# Altium schematic sheet SH30 - POWER.SchDoc
size 386 x 246 mm
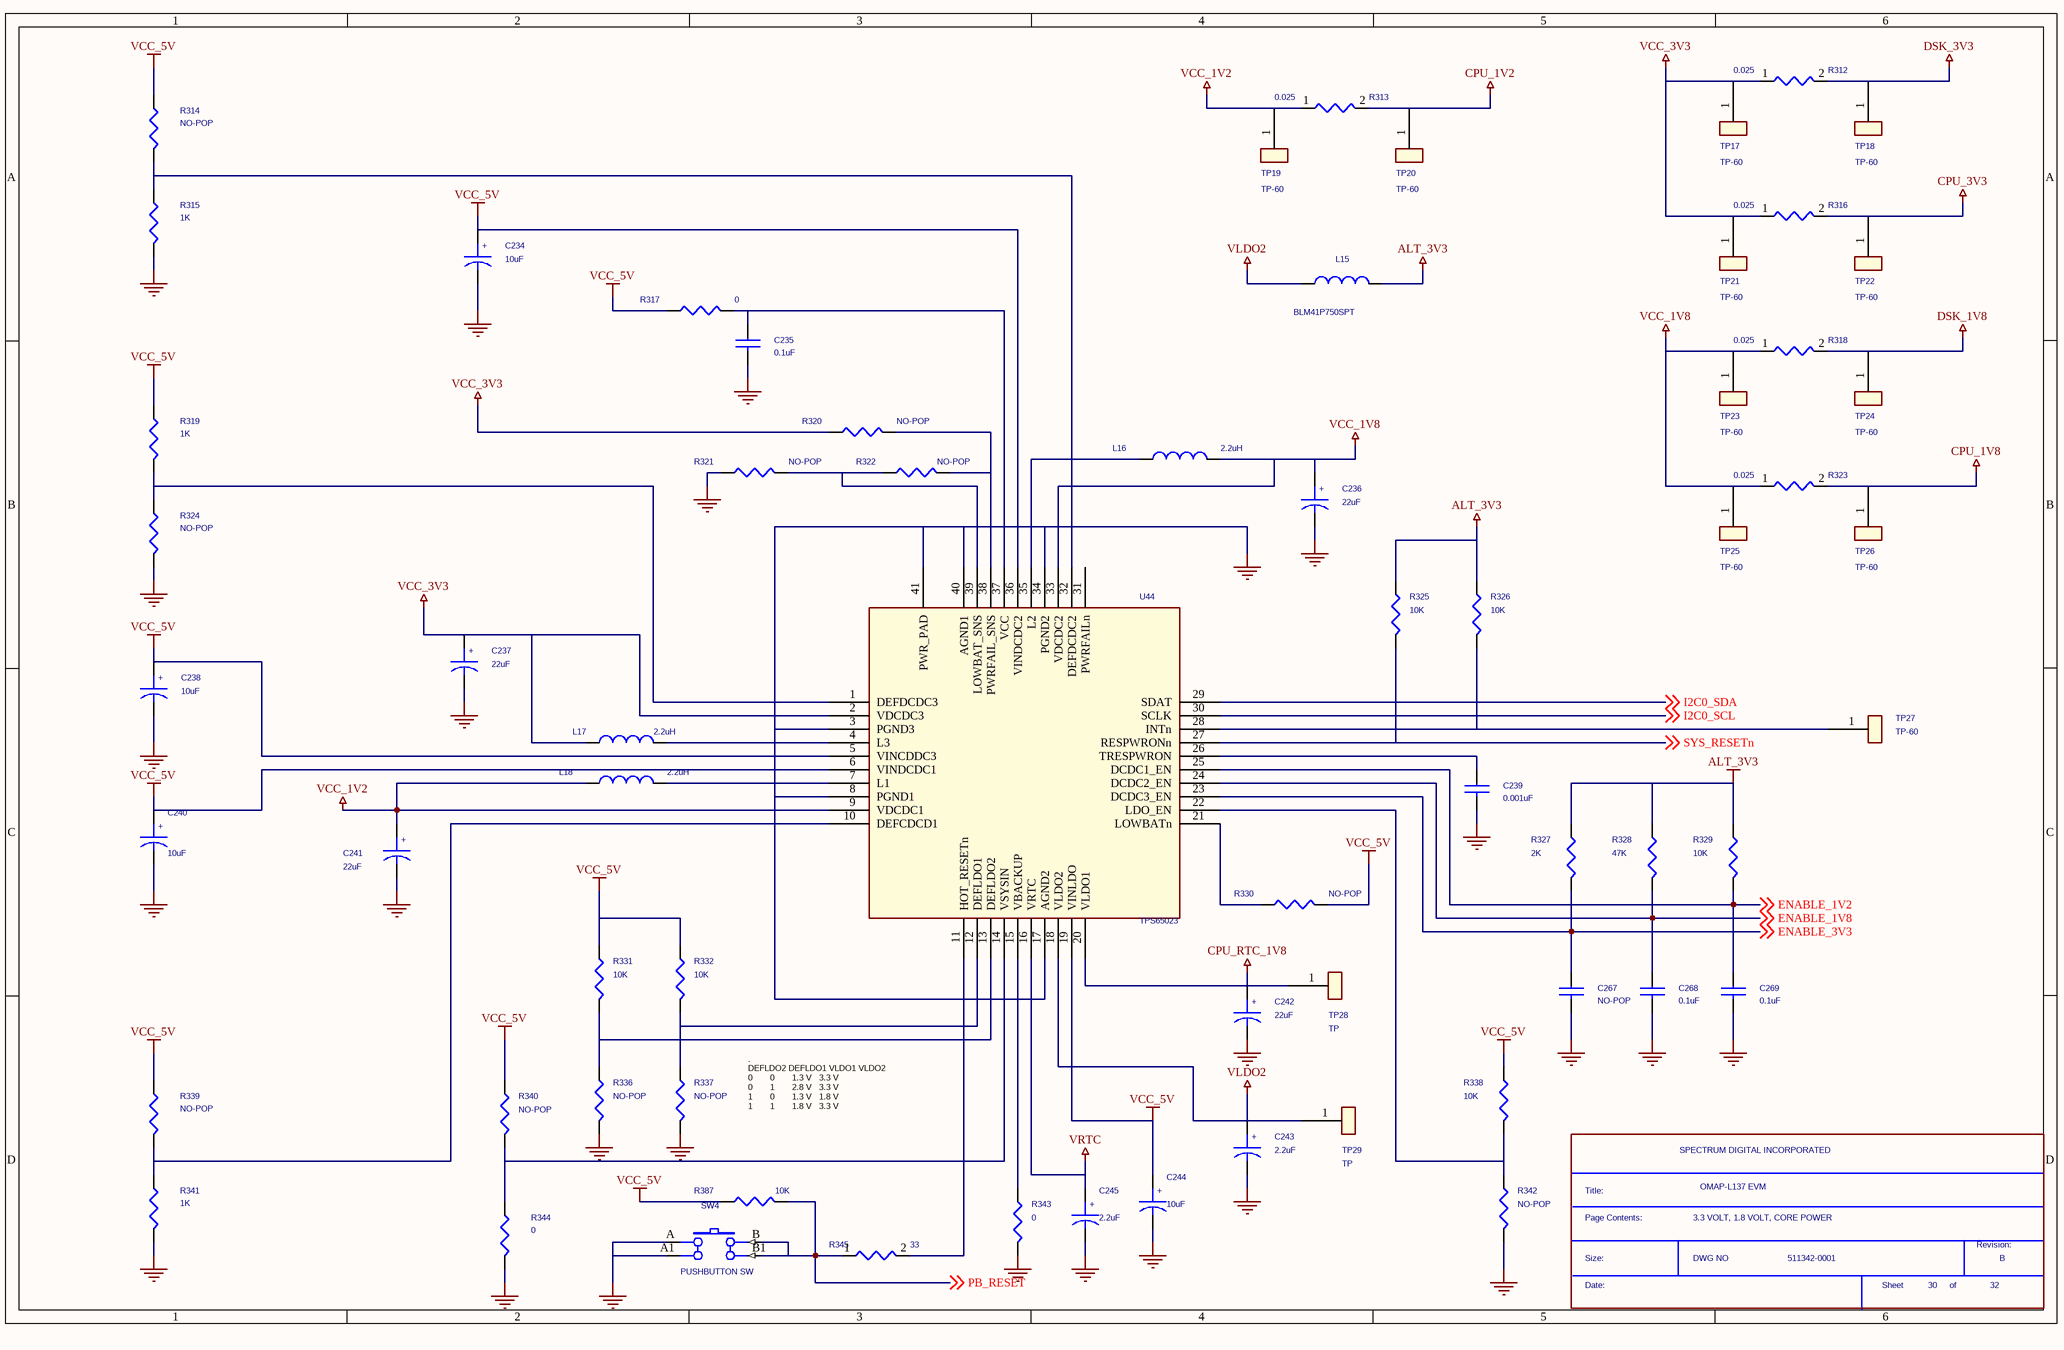
[diagram p0: SH30 - POWER.SchDoc]

## Parts
*  Page Contents:: 3.3 VOLT, 1.8 VOLT, CORE POWER  RevCode: B  Title: OMAP-L137 EVM  OrgName: SPECTRUM DIGITAL INCORPORATED  Doc: 511342-0001  Page Number: 30  Page Count: 32  (hidden comment: SDTitleBlock)  (graphical)
C234  10uF  [c1206-40x70-POL]
C235  0.1uF  [c402-25]
C236  22uF  [C1206-40X70]
C237  22uF  [C1206-40X70]
C238  10uF  [c1206-40x70-POL]
C239  0.001uF  [c402-25]
C240  10uF  [c1206-40x70-POL]
C241  22uF  [C1206-40X70]
C242  22uF  [C1206-40X70]
C243  2.2uF  [c603-35x45]
C244  10uF  [c1206-40x70-POL]
C245  2.2uF  [c603-35x45]
C267  NO-POP  [c402-25]
C268  0.1uF  [c402-25]
C269  0.1uF  [c402-25]
L15  BLM41P750SPT  [FB1806-41X70]
L16  2.2uH  [ind_vlcf]
L17  2.2uH  [ind_vlcf]
L18  2.2uH  [ind_vlcf]
R312  0.025  [R2512]
R313  0.025  [R2512]
R314  NO-POP  [r402-25]
R315  1K  [r402-25]
R316  0.025  [R2512]
R317  0  [r402-25]
R318  0.025  [R2512]
R319  1K  [r402-25]
R320  NO-POP  [r402-25]
R321  NO-POP  [r402-25]
R322  NO-POP  [r402-25]
R323  0.025  [R2512]
R324  NO-POP  [r402-25]
R325  10K  [r402-25]
R326  10K  [r402-25]
R327  2K  [r402-25]
R328  47K  [r402-25]
R329  10K  [r402-25]
R330  NO-POP  [r402-25]
R331  10K  [r402-25]
R332  10K  [r402-25]
R336  NO-POP  [r402-25]
R337  NO-POP  [r402-25]
R338  10K  [r402-25]
R339  NO-POP  [r402-25]
R340  NO-POP  [r402-25]
R341  1K  [r402-25]
R342  NO-POP  [r402-25]
R343  0  [r402-25]
R344  0  [r402-25]
R345  33  [r402-25]
R387  10K  [r402-25]
SW4  PUSHBUTTON SW  [???]
TP17  TP-60  [CON1]
TP18  TP-60  [CON1]
TP19  TP-60  [CON1]
TP20  TP-60  [CON1]
TP21  TP-60  [CON1]
TP22  TP-60  [CON1]
TP23  TP-60  [CON1]
TP24  TP-60  [CON1]
TP25  TP-60  [CON1]
TP26  TP-60  [CON1]
TP27  TP-60  [CON1]
TP28  TP  [CON1]
TP29  TP  [CON1]
U44  TPS65023  [rsb40-9x39]

## Nets
ALT_3V3: L15.1 R325.1 R326.1 R327.1 R328.1 R329.1
CPU_1V2: R313.2 TP20.1
CPU_1V8: R323.2 TP26.1
CPU_3V3: R316.2 TP22.1
CPU_RTC_1V8: C242.1 TP28.1 U44.20(VLDO1)
DSK_1V8: R318.2 TP24.1
DSK_3V3: R312.2 TP18.1
GND: C234.2 C235.2 C236.2 C237.2 C238.2 C239.2 C240.2 C241.2 C242.2 C243.2 C244.2 C245.2 C267.2 C268.2 C269.2 R315.2 R321.1 R324.2 R336.2 R337.2 R341.2 R342.2 R343.2 R344.2 SW4.A SW4.A1 U44.3(PGND3) U44.8(PGND1) U44.17(AGND2) U44.34(PGND2) U44.40(AGND1) U44.41(PWR_PAD)
VCC_1V2: C241.1 L18.1 R313.1 TP19.1 U44.9(VDCDC1)
VCC_1V8: C236.1 L16.2 R318.1 R323.1 TP23.1 TP25.1 U44.33(VDCDC2)
VCC_3V3: C237.1 L17.1 R312.1 R316.1 R320.1 TP17.1 TP21.1 U44.2(VDCDC3)
VCC_5V: C234.1 C238.1 C240.1 C244.1 R314.1 R317.1 R319.1 R330.2 R331.1 R332.1 R338.1 R339.1 R340.1 R387.1 U44.5(VINCDDC3) U44.6(VINDCDC1) U44.19(VINLDO) U44.36(VINDCDC2)
VLDO2: C243.1 L15.2 TP29.1 U44.18(VLDO2)
VRTC: C245.1 U44.16(VRTC)
ENABLE_1V2: C269.1 R329.2 U44.25(DCDC1_EN) ; off-sheet ENABLE_1V2
ENABLE_1V8: C268.1 R328.2 U44.24(DCDC2_EN) ; off-sheet ENABLE_1V8
ENABLE_3V3: C267.1 R327.2 U44.23(DCDC3_EN) ; off-sheet ENABLE_3V3
I2C0_SCL: U44.30(SCLK) ; off-sheet I2C0_SCL
I2C0_SDA: U44.29(SDAT) ; off-sheet I2C0_SDA
PB_RESET: R345.1 R387.2 SW4.B SW4.B1 ; off-sheet PB_RESET
SYS_RESETn: R325.2 U44.27(RESPWRONn) ; off-sheet SYS_RESETn
NetC235_1: C235.1 R317.2 U44.37(VCC)
NetC239_1: C239.1 U44.26(TRESPWRON)
NetL16_1: L16.1 U44.35(L2)
NetL17_2: L17.2 U44.4(L3)
NetL18_2: L18.2 U44.7(L1)
NetR314_2: R314.2 R315.1 U44.32(DEFDCDC2)
NetR319_2: R319.2 R324.1 U44.1(DEFDCDC3)
NetR320_2: R320.2 R322.2 U44.38(PWRFAIL_SNS)
NetR321_2: R321.2 R322.1 U44.39(LOWBAT_SNS)
NetR326_2: R326.2 TP27.1 U44.28(INTn)
NetR330_1: R330.1 U44.21(LOWBATn)
NetR331_2: R331.2 R336.1 U44.13(DEFLDO2)
NetR332_2: R332.2 R337.1 U44.12(DEFLDO1)
NetR338_2: R338.2 R342.1 U44.22(LDO_EN)
NetR339_2: R339.2 R341.1 U44.10(DEFCDCD1)
NetR340_2: R340.2 R344.1 U44.14(VSYSIN)
NetR343_1: R343.1 U44.15(VBACKUP)
NetR345_2: R345.2 U44.11(HOT_RESETn)

Not connected (* = marked no-connect by the designer): U44 31(PWRFAILn)

## Notes on the sheet
- .
  DEFLDO2 DEFLDO1 VLDO1 VLDO2
  0       0       1.3 V   3.3 V
  0       1       2.8 V   3.3 V
  1       0       1.3 V   1.8 V
  1       1       1.8 V   3.3 V
- (in symbol CAP P_0) +
- (in symbol SDTitleBlock) Title:; Page Contents:; Revision:; Size:; DWG NO; Date:; Sheet; of

## Library data of the parts
C234 C238 C240 C244 = CAP P_0: Part #: 101003-0101R; SD PCB Footprint: EIA1210
C235 C268 C269 = CAP NP: Part #: 101587-1100R
C236 C237 C241 C242 = CAP P_0: Part #: 101064-0221R; SD PCB Footprint: EIA1210
C239 = CAP NP: Part #: 102058-1102R
C243 C245 = CAP P_0: Part #: 101007-0220R; SD PCB Footprint: EIA1210
C267 = CAP NP: Part #: C0402-NOPOP
L15 = INDUCTOR_0: Part Number: 134; Part #: 101126-0001R
L16-L18 = INDUCTOR_0: Part Number: 134; Part #: 102747-0220R
R312 R313 R316 R318 R323 = R_2: Part #: 100830-0025R; SD PCB Footprint: EIA0603
R314 R320-R322 R324 R330 R336 R337 R339 R340 = R_0: Part #: R0402-NOPOP
R315 R319 R341 = R_0: Part #: 101370-1002R
R317 R344 = R_0: Part #: 101370-0001R
R325 R326 R329 R331 R332 R338 = R_0: Part #: 101370-1003R
R327 = R_0: Part #: 101370-2002R
R328 = R_0: Part #: 101370-4703R
R342 = R_0: Part #: R0402-nopop
R343 = R: Part #: 101370-0001R
R345 = R_2: Part #: 101370-3300R; SD PCB Footprint: EIA0603
R387 = R: Part #: 101370-1003R
SW4 = EVQ-PLMA15_2: Pushbutton, Momentary, Thru Hole; Part #: 101215-0001R; SD PCB Footprint: 101215
TP17-TP29 = TEST POINT_0: Part #: 100115-0001R
  TP17-TP27: SD PCB Footprint: CON1
U44 = TPS65023_0: Part #: 102746-0001R